# EAGLE schematic UV_MONITOR_V2_6 (EAGLE 8.4.2)
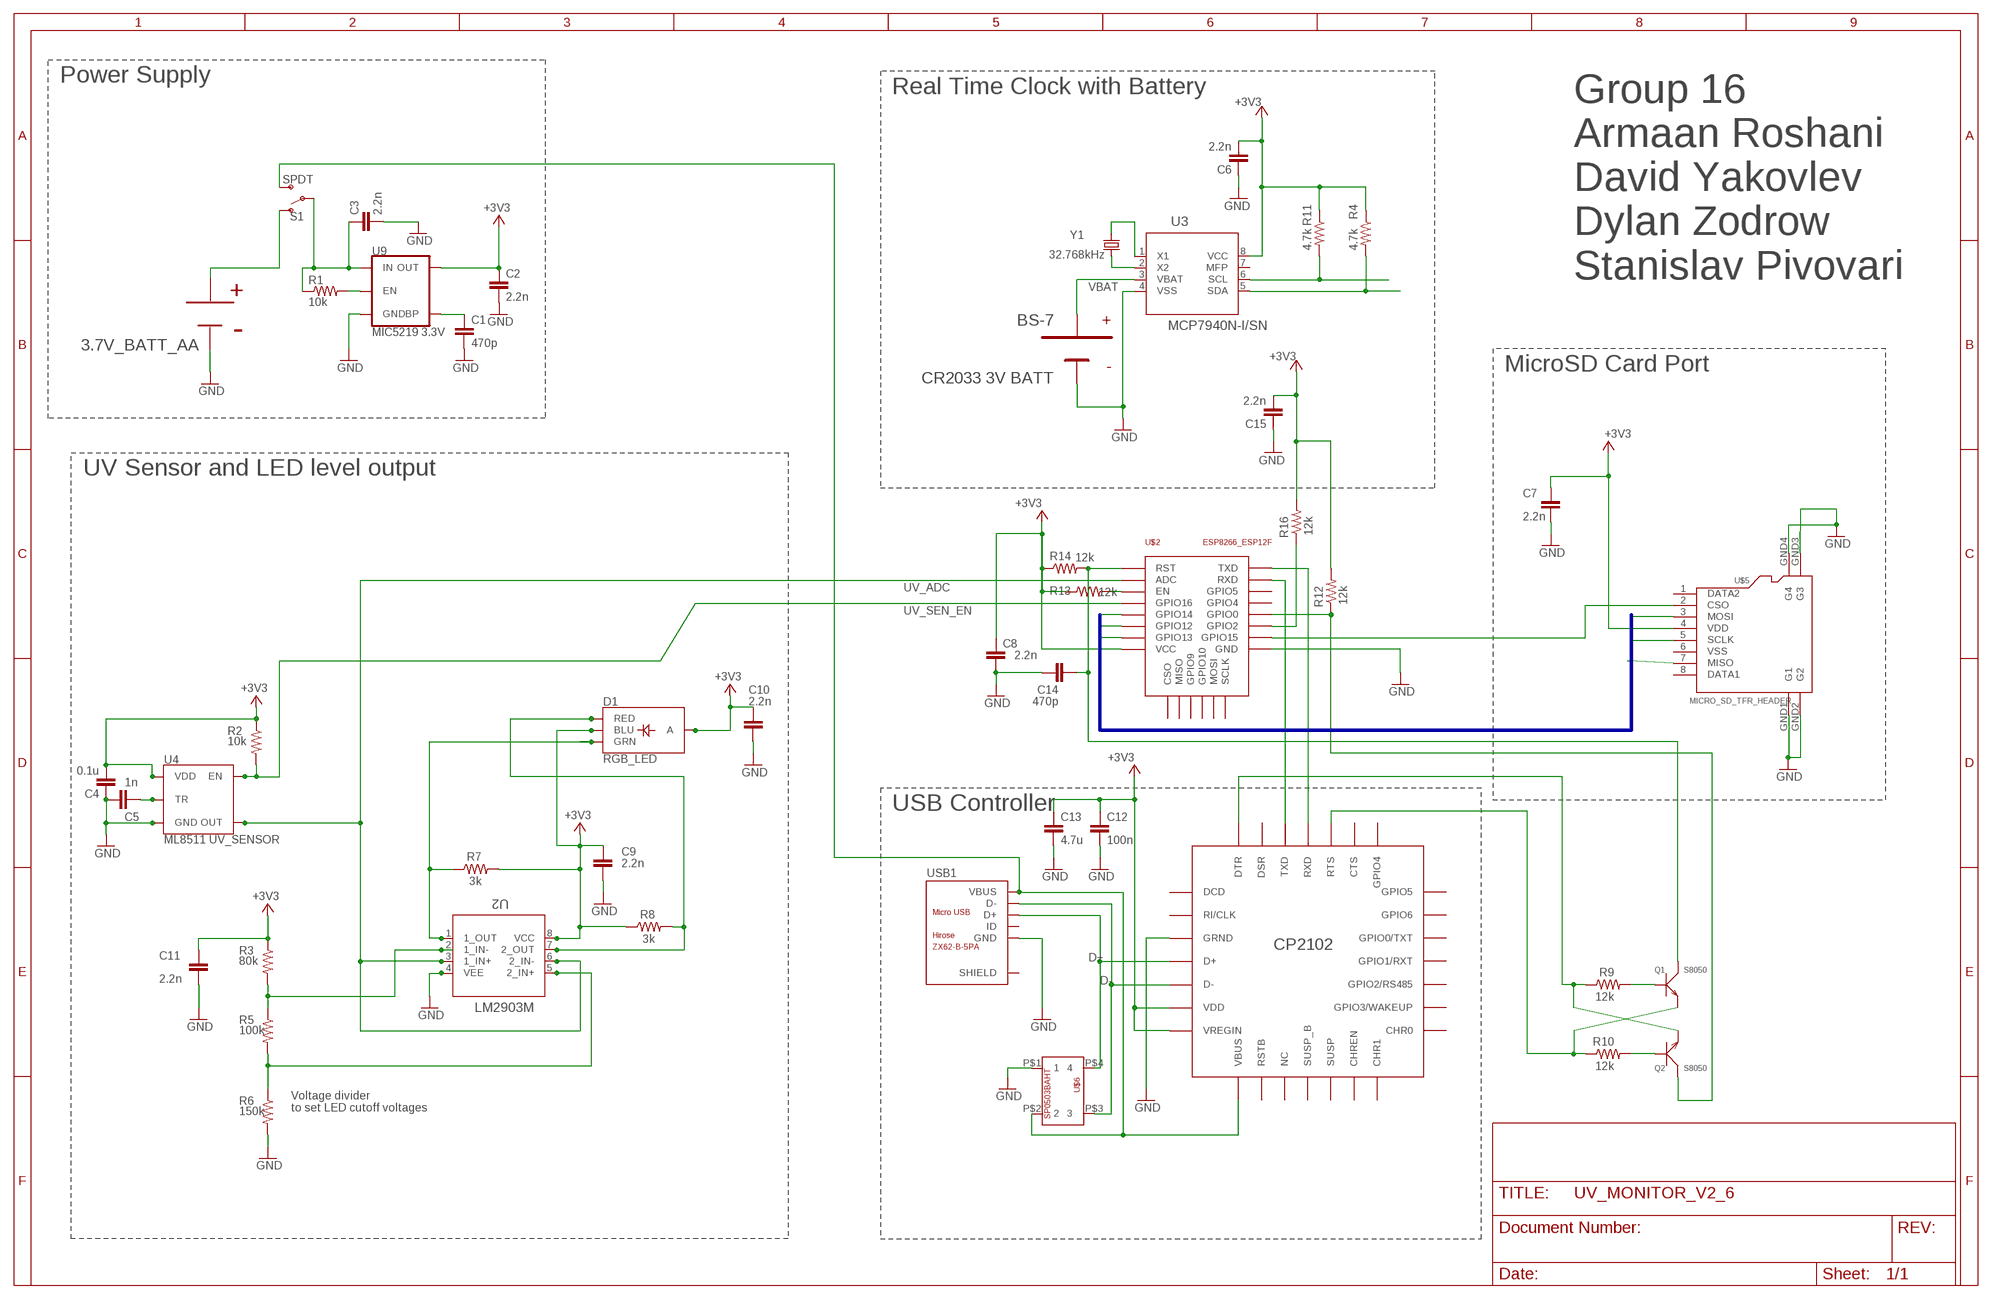
[diagram p0: schematic, sheet 1]

## Parts
C1  470p  C-EUC0805  [C0805]
C2  2.2n  C-EUC0805  [C0805]
C3  2.2n  C-EUC0805  [C0805]
C4  0.1u  C-EUC0805  [C0805]
C5  1n  C-EUC0805  [C0805]
C6  2.2n  C-EUC0805  [C0805]
C7  2.2n  C-EUC0805  [C0805]
C8  2.2n  C-EUC0805  [C0805]
C9  2.2n  C-EUC0805  [C0805]
C10  2.2n  C-EUC0805  [C0805]
C11  2.2n  C-EUC0805  [C0805]
C12  100n  C-EUC0805  [C0805]
C13  4.7u  C-EUC0805  [C0805]
C14  470p  C-EUC0805  [C0805]
C15  2.2n  C-EUC0805  [C0805]
D1  RGB_LED  LED-RGB-CASMD  [LED-TRICOLOR-SMD]
Q1  S8050  SMD-TRANSISTORS-NPN-25V-500MW-S8050(SOT-23)  [SOT-23]
Q2  S8050  SMD-TRANSISTORS-NPN-25V-500MW-S8050(SOT-23)  [SOT-23]
R1  10k  R-US_R0805  [R0805]
R2  10k  R-US_R0805  [R0805]
R3  80k  R-US_R0805  [R0805]
R4  4.7k  R-US_R0805  [R0805]
R5  100k  R-US_R0805  [R0805]
R6  150k  R-US_R0805  [R0805]
R7  3k  R-US_R0805  [R0805]
R8  3k  R-US_R0805  [R0805]
R9  12k  R-US_R0805  [R0805]
R10  12k  R-US_R0805  [R0805]
R11  4.7k  R-US_R0805  [R0805]
R12  12k  R-US_R0805  [R0805]
R13  12k  R-US_R0805  [R0805]
R14  12k  R-US_R0805  [R0805]
R16  12k  R-US_R0805  [R0805]
S1  SPDT  SWITCH-SPDT-SMD-RIGHT-ANGLE  [SWITCH_SPST_SMD_A]
U2  LM2903M  [M08A]
U3  MCP7940N-I/SN  [SOIC8-N_MC]
U4  ML8511 UV_SENSOR  ML8511  [ML8511]
U9  MIC5219 3.3V  V_REG_MIC52193.3V  [SOT23-5]
U$1  CP2102  [CP2102]
U$2  ESP12F  [ESP12F]
U$3  BK-53  [BK-53]
U$4  BS-7  [BS-7]
U$5  MICRO_SD_TFR_HEADER  [MICRO_SD_TFR_HEADER]
U$6  SP0503BAHT  [SP0503BAHT]
USB1  ZX62-B-5PA  MICRO-USB-SMD(ZX62-B-5PA)  [MICRO-USB5+6P-SMD-0.65-AB]
Y1  32.768kHz  CRYSTAL-32.768KHZSMD-2X6  [CRYSTAL-SMD-2X6-CYL]

## Nets
+3V3: C2.1 C4.2 C6.2 C7.1 C8.1 C9.1 C10.1 C11.1 C12.1 C13.1 C15.2 D1.A D1.B(BLU) R2.1 R3.1 R4.1 R7.2 R8.1 R11.1 R12.2 R13.1 R14.1 R16.2 U2.8(VCC) U3.8(VCC) U4.7(VDD) U9.5(OUT) U$1.VDD U$1.VREGIN U$2.VCC U$5.4(VDD)
BP: C1.1 U9.4(BP)
D+: U$1.D+ U$6.P$4 USB1.3(D+)
D-: U$1.D- U$6.P$3 USB1.2(D-)
EN: R1.2 U9.3(EN)
GND: C1.2 C2.2 C3.2 C4.1 C5.2 C6.1 C7.2 C8.2 C9.2 C10.2 C11.2 C12.2 C13.2 C14.1 C15.1 R6.2 U2.4(VEE) U3.4(VSS) U4.5(GND) U9.2(GND) U$1.GND(GRND) U$1.GRND U$2.GND U$3.GND1 U$3.GND2 U$4.GND U$5.GND1(G1) U$5.GND2(G2) U$5.GND3(G3) U$5.GND4(G4) U$6.P$1 USB1.5(GND)
GREEN_LED: D1.G(GRN) R7.1 U2.1(1_OUT)
H_REF: R3.2 R5.1 U2.2(1_IN-)
L_REF: R5.2 R6.1 U2.5(2_IN+)
MAIN_BAT: C3.1 R1.1 S1.2(P) U9.1(IN)
N$1: Q1.1(B) R9.2
N$2: U3.2(X2) Y1.X1
N$3: Q2.1(B) R10.2
N$4: R13.2 U$2.EN
N$5: U$2.GPIO12 U$5.7(MISO)
N$6: U3.1(X1) Y1.X2
N$7: U$2.GPIO15 U$5.2(CSO)
N$9: U$1.RXD U$2.TXD
N$10: U$1.TXD U$2.RXD
N$11: Q2.2(E) R9.1 U$1.DTR
N$12: C14.2 Q1.3(C) R14.2 U$2.RST
N$13: Q2.3(C) R12.1 U$2.GPIO0
N$14: R16.1 U$2.GPIO2
N$16: U$2.GPIO13 U$5.5(SCLK)
N$17: U$2.GPIO14 U$5.3(MOSI)
RED_LED: D1.R(RED) R8.2 U2.7(2_OUT)
RTC_SCL: R11.2 U3.6(SCL)
RTC_SDA: R4.2 U3.5(SDA)
RTS: Q1.2(E) R10.1 U$1.RTS
TR: C5.1 U4.10(TR)
UV_ADC: U2.3(1_IN+) U2.6(2_IN-) U4.8(OUT) U$2.ADC
UV_SEN_EN: R2.2 U4.4(EN) U$2.GPIO16
VBAT: U3.3(VBAT) U$4.VBAT
VBATT: S1.1(O) U$3.VBAT1(VBAT) U$3.VBAT2(VBAT)
VBUS: S1.3(S) U$1.VBUS U$6.P$2 USB1.1(VBUS)
Unconnected: U3.7(MFP) U$1.CHR0 U$1.CHR1 U$1.CHREN U$1.CTS U$1.DCD U$1.DSR U$1.GPIO0/TXT U$1.GPIO1/RXT U$1.GPIO2/RS485 U$1.GPIO3/WAKEUP U$1.GPIO4 U$1.GPIO5 U$1.GPIO6 U$1.NC U$1.RI/CLK U$1.RSTB U$1.SUSP U$1.SUSPB(SUSP_B) U$2.CSO U$2.GPIO4 U$2.GPIO5 U$2.GPIO9 U$2.GPIO10 U$2.MISO U$2.MOSI U$2.SCLK U$5.1(DATA2) U$5.6(VSS) U$5.8(DATA1) USB1.4(ID) USB1.P1(SHIELD) USB1.P2(SHIELD) USB1.P3(SHIELD) USB1.P4(SHIELD) USB1.P5(SHIELD) USB1.P6(SHIELD)

## Buses
B$1

## Notes on the sheet
- Power Supply
- Real Time Clock with Battery
- Group 16
  Armaan Roshani
  David Yakovlev
  Dylan Zodrow
  Stanislav Pivovari
- MicroSD Card Port
- UV Sensor and LED level output
- USB Controller
- Voltage divider
  to set LED cutoff voltages

## Library data of the parts
C1-C15 = rcl:C-EU: CAPACITOR, European symbol; SPICEPREFIX: C
D1 = SparkFun-LED:LED-RGB-CA: LED-RGB Diffused Common Anode Packages: LED RGB-THRU P-LCC-4-3 LED-TRICOLOR-SMD SparkFun Products: RGB Diffused Common Anode- Diffuse <[https://www.sparkfun.com/products/10821]> RGB Diffused Common Anode - Clear <[https://www.sparkfun.com/products/10820]> Qduino Mini <[https://www.sparkfun.com/products/13614]> Triple Output LED RGB - SMD <https://www.sparkfun.com/products/7844>; PROD_ID: DIO-08324
Q1 Q2 = Seeed-Transistor:SMD-TRANSISTORS-NPN-25V-500MW-S8050(SOT-23): 305010017; MPN: S8050
R1-R14 R16 = rcl:R-US_: RESISTOR, American symbol; SPICEPREFIX: R
S1 = SparkFun-Switches:SWITCH-SPDT: Single Pole, Double Throw (SPDT) Switch Single-pole, double-throw (SPDT) switch. Variant Overview SMD-AYZ0202 Surface Mount DPDT Switch <https://www.sparkfun.com/products/597> (COM-00597) Used on e.g. LilyPad Arduino USB - ATmega32U4 Board <https://www.sparkfun.com/products/12049> PTH-11.6X4.0MM SPDT Mini Power Switch <https://www.sparkfun.com/products/102> (COM-00102) Used on e.g. SparkFun Simon Says - Through-Hole Soldering Kit <https://www.sparkfun.com/products/10547> (KIT-10547) PTH-11.6X4.0MM-KIT KIT version of SPDT Mini Power Switch - Simplifies soldering by removing tStop of switch pins - only one side can be soldered. PTH-11.6X4.0MM-LOCK LOCK version of SPDT Mini Power Switch - Offset pins hold switch in place for easier soldering. SMD-RIGHT-ANGLE Surface Mount Right Angle Switch <https://www.sparkfun.com/products/10860> (COM-10860) Used on e.g. SparkFun ESP8266 Thing <https://www.sparkfun.com/products/13231>; PROD_ID: SWCH-10651; SF_SKU: COM-10860
U2 = LM2903M:LM2903M; MANUFACTURER_PART_NUMBER: LM2903M; VENDOR: Texas Instruments
U3 = MCP7940N:MCP7940N-I/SN; MANUFACTURER_PART_NUMBER: MCP7940NISN; VENDOR: MICROCHIP
U4 = SparkFun-Sensors:ML8511: Lapis ML8511 Ultraviolet Sensor The MP8511 UV (ultraviolet) Sensor works by outputing an analog signal in relation to the amount of UV light that’s detected. This sensor detects 280-390nm light most effectively. This is categorized as part of the UVB (burning rays) spectrum and most of the UVA (tanning rays) spectrum. It outputs a analog voltage that is linearly related to the measured UV intensity (mW/cm2). Datasheet <https://cdn.sparkfun.com/datasheets/Sensors/LightImaging/ML8511_3-8-13.pdf> SparkFun Products SparkFun UV Sensor Breakout - ML8511 <https://www.sparkfun.com/products/12705> (SEN-12705); PROD_ID: IC-11927
U9 = SparkFun-IC-Power:V_REG_MIC5219: V_REG MIC5219 Standard 3.3V and 5V 500mA LDO voltage regulator in SOT-23 layout. Micrel part MIC5219. BP (by-pass) pin is used to lower output noise with 470pF cap, may be left open.; PROD_ID: VREG-09872
U$1 = CP2102:CP2102
U$2 = ESP8266-ESP12F:ESP12F
U$3 = BK-53:BK-53
U$4 = BS-7:BS-7
U$5 = MicroSD TFR Header:MICRO_SD_TFR_HEADER
U$6 = SP0503BAHT:SP0503BAHT
USB1 = Seeed-Connector:MICRO-USB-SMD(ZX62-B-5PA): 320010005; MPN: ZX62-B-5PA
Y1 = SparkFun-Clocks:CRYSTAL-32.768KHZ: 32.768kHz Crystal Frequency: 32.768kHz Frequency Stability: ±20ppm Load Capacitance: 12.5pF (PTH-2X6 & SMD-3.2X1.5), 6pF (SMD-2X6) SparkFun Products: SparkFun BigTime Watch Kit <https://www.sparkfun.com/products/11734> SparkFun nRF52832 Breakout <https://www.sparkfun.com/products/13990> SparkFun Real Time Clock Module <https://www.sparkfun.com/products/12708>; PROD_ID: XTAL-07894

## Net classes
0 default: clearance 0.205 mm